# EAGLE design synchronizer v1.1 (EAGLE 6.5.0)

## Sheet 1 of 2: uC
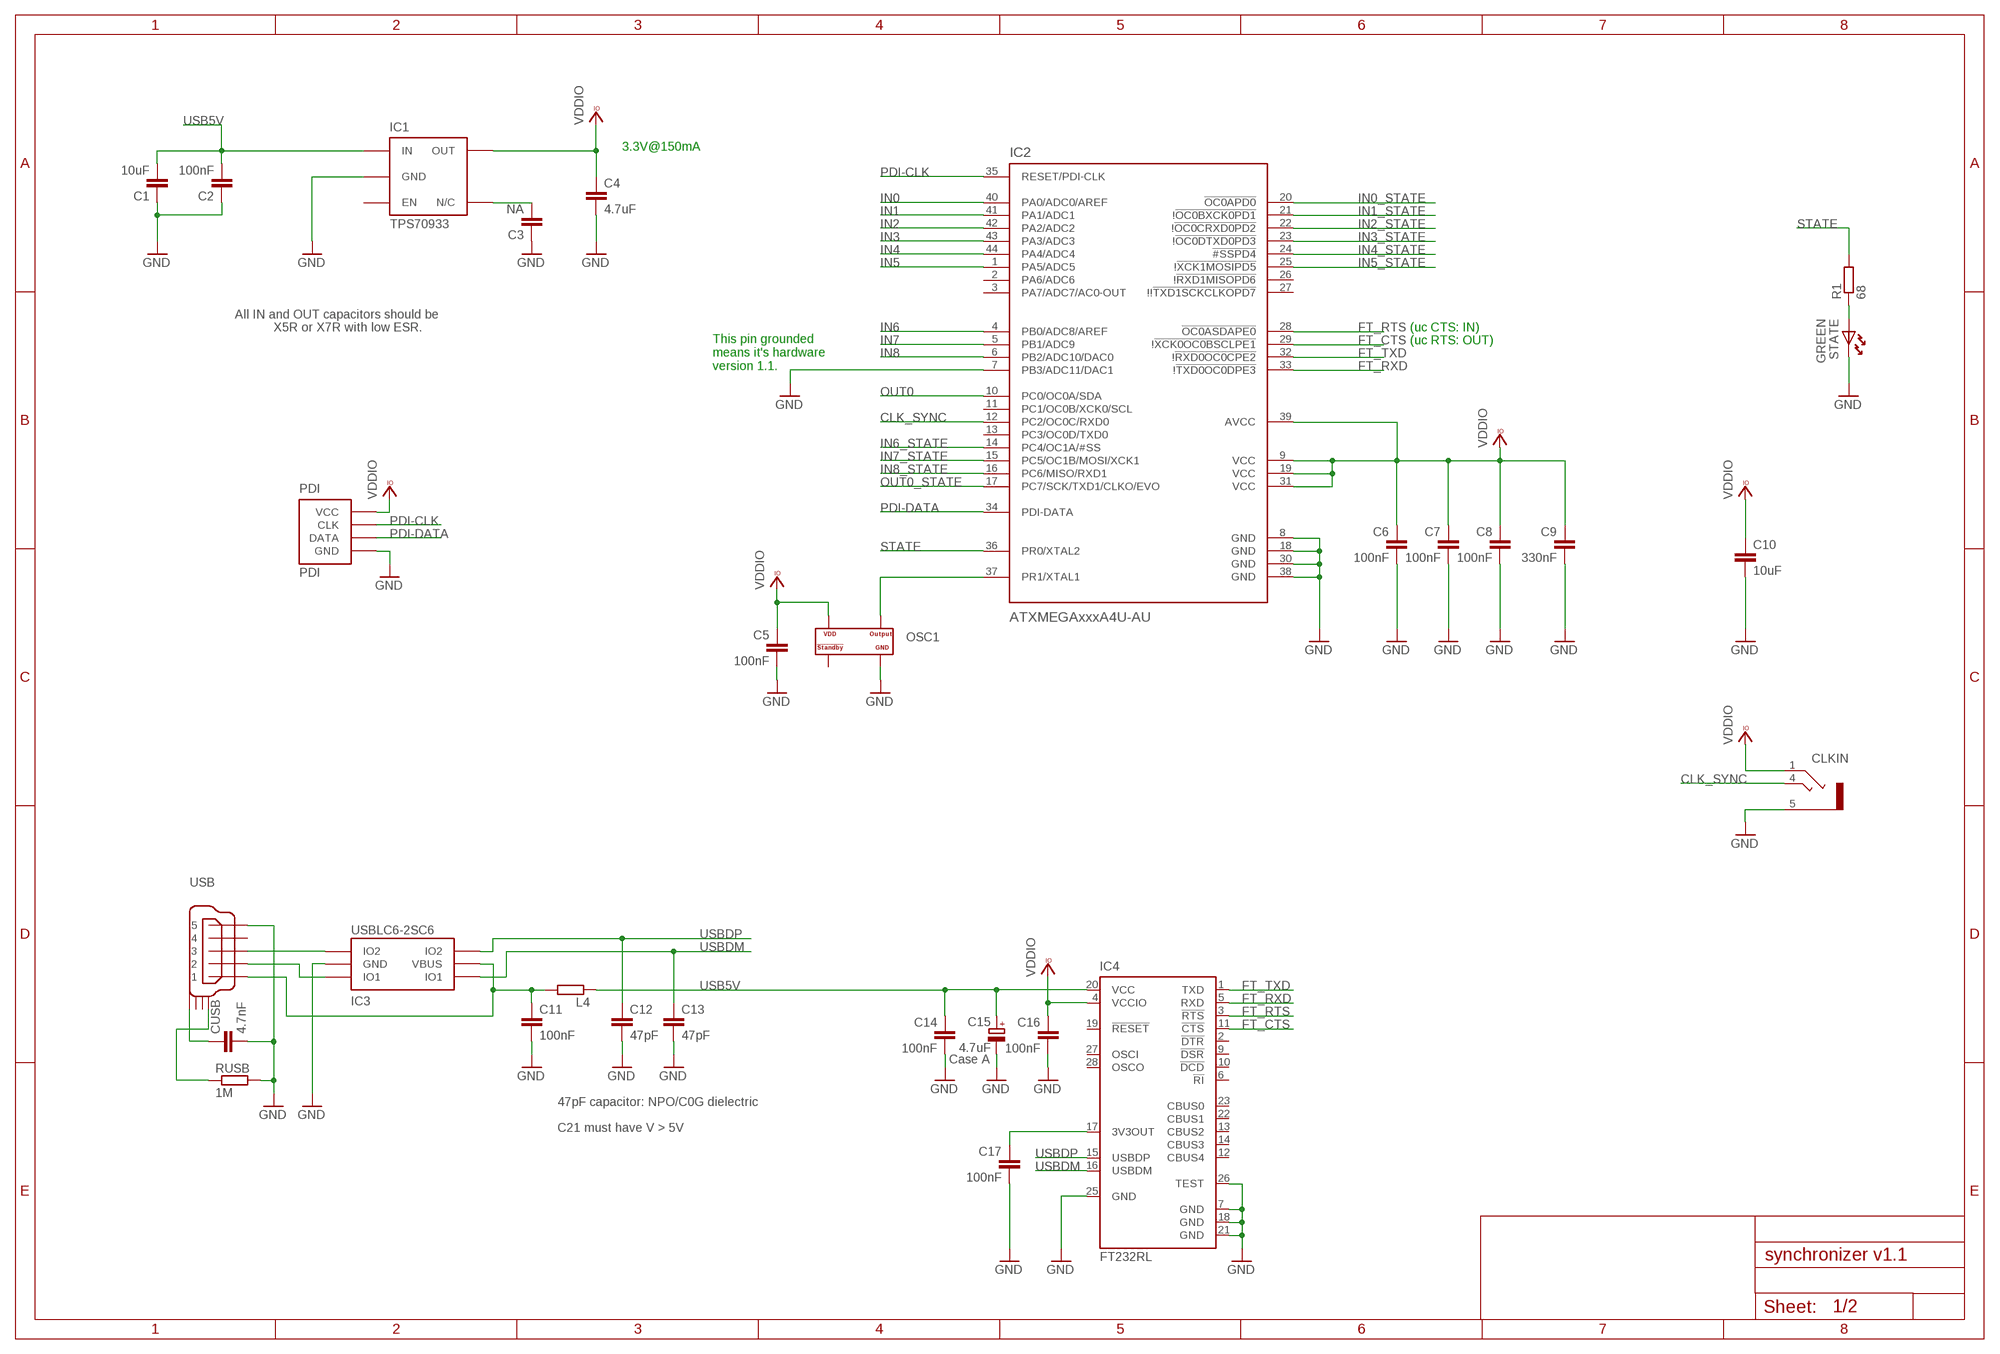
[diagram p0: schematic, sheet 1]

### Parts
C1  10uF  C-EUC0603  [C0603]
C2  100nF  C-EUC0402  [C0402]
C3  NA  C-EUC0402  [C0402]
C4  4.7uF  C-EUC0603  [C0603]
C5  100nF  C-EUC0402  [C0402]
C6  100nF  C-EUC0402  [C0402]
C7  100nF  C-EUC0402  [C0402]
C8  100nF  C-EUC0402  [C0402]
C9  330nF  C-EUC0402  [C0402]
C10  10uF  C-EUC0603  [C0603]
C11  100nF  C-EUC0402  [C0402]
C12  47pF  C-EUC0402  [C0402]
C13  47pF  C-EUC0402  [C0402]
C14  100nF  C-EUC0402  [C0402]
C15  4.7uF  CPOL-EUA/3216-18W  [A/3216-18W]
C16  100nF  C-EUC0402  [C0402]
C17  100nF  C-EUC0402  [C0402]
CLKIN  STEREO_JACK  [35RASMT2BHNTRX]
CUSB  4.7nF  C-EUC0402  [C0402]
IC1  TPS70933  TLV700XX  [TSOT23-5]
IC2  ATXMEGAxxxA4U-AU  AT-XMEGA-XXA4-AU  [QFP80P1200X1200X120-44N]
IC3  USBLC6-2SC6  USBLC6-2  [SOT23-6L]
IC4  FT232RL  [SSOP28]
L4  ???  R-EU_R0805  [R0805]
OSC1  OSCILLATOR  [OSCILLATOR_3.2X2.5]
PDI  PDI  [PDI_2.54_1X4]
R1  68  R-EU_R0402  [R0402]
RUSB  1M  R-EU_R0603  [R0603]
STATE  GREEN  LEDHAND  [LED_HAND]
USB  USB_MINI_B  [240-0002-1]

### Nets
CLK_SYNC: CLKIN.4 IC2.12(PC2/OC0C/RXD0)
FT_CTS: IC2.29(!!XCK0OC0BSCLPE1) IC4.11(!CTS)
FT_RTS: IC2.28(!OC0ASDAPE0) IC4.3(!RTS)
FT_RXD: IC2.33(!!TXD0OC0DPE3) IC4.5(RXD)
FT_TXD: IC2.32(!!RXD0OC0CPE2) IC4.1(TXD)
GND: C1.1 C2.1 C3.1 C4.2 C5.2 C6.2 C7.2 C8.2 C9.2 C10.2 C11.2 C12.2 C13.2 C14.2 C15.- C16.2 C17.2 CLKIN.5 CUSB.2 IC1.2(GND) IC2.7(PB3/ADC11/DAC1) IC2.8(GND) IC2.18(GND) IC2.30(GND) IC2.38(GND) IC3.P$2(GND) IC4.7(GND) IC4.18(GND) IC4.21(GND) IC4.25(GND) IC4.26(TEST) OSC1.P$2(GND) PDI.P$1(GND) RUSB.2 STATE.K USB.P$5 ; also sheet 2
IN0: IC2.40(PA0/ADC0/AREF) ; also sheet 2
IN0_STATE: IC2.20(!OC0APD0) ; also sheet 2
IN1: IC2.41(PA1/ADC1) ; also sheet 2
IN1_STATE: IC2.21(!!OC0BXCK0PD1) ; also sheet 2
IN2: IC2.42(PA2/ADC2) ; also sheet 2
IN2_STATE: IC2.22(!!OC0CRXD0PD2) ; also sheet 2
IN3: IC2.43(PA3/ADC3) ; also sheet 2
IN3_STATE: IC2.23(!!OC0DTXD0PD3) ; also sheet 2
IN4: IC2.44(PA4/ADC4) ; also sheet 2
IN4_STATE: IC2.24(!#SSPD4) ; also sheet 2
IN5: IC2.1(PA5/ADC5) ; also sheet 2
IN5_STATE: IC2.25(!!XCK1MOSIPD5) ; also sheet 2
IN6: IC2.4(PB0/ADC8/AREF) ; also sheet 2
IN6_STATE: IC2.14(PC4/OC1A/#SS) ; also sheet 2
IN7: IC2.5(PB1/ADC9) ; also sheet 2
IN7_STATE: IC2.15(PC5/OC1B/MOSI/XCK1) ; also sheet 2
IN8: IC2.6(PB2/ADC10/DAC0) ; also sheet 2
IN8_STATE: IC2.16(PC6/MISO/RXD1) ; also sheet 2
N$23: R1.1 STATE.A
N$32: C3.2 IC1.4(N/C)
N$38: C17.1 IC4.17(3V3OUT)
N$39: C11.1 IC3.P$5(VBUS) L4.2 USB.P$1
N$40: IC3.P$1(IO1) USB.P$2
N$50: IC3.P$3(IO2) USB.P$3
N$59: CUSB.1 USB.SHIELD_4
N$61: RUSB.1 USB.SHIELD_1
OSC1: IC2.37(PR1/XTAL1) OSC1.P$3(OUTPUT)
OUT0: IC2.10(PC0/OC0A/SDA) ; also sheet 2
OUT0_STATE: IC2.17(PC7/SCK/TXD1/CLKO/EVO) ; also sheet 2
PDI-CLK: IC2.35(RESET/PDI-CLK) PDI.P$3(CLK)
PDI-DATA: IC2.34(PDI-DATA) PDI.P$2(DATA)
STATE: IC2.36(PR0/XTAL2) R1.2
USB5V: C1.2 C2.2 C14.1 C15.+ IC1.1(IN) IC4.20(VCC) L4.1 ; also sheet 2
USBDM: C13.1 IC3.P$6(IO1) IC4.16(USBDM)
USBDP: C12.1 IC3.P$4(IO2) IC4.15(USBDP)
VCCIO: C4.1 C5.1 C6.1 C7.1 C8.1 C9.1 C10.1 C16.1 CLKIN.1 IC1.5(OUT) IC2.9(VCC) IC2.19(VCC) IC2.31(VCC) IC2.39(AVCC) IC4.4(VCCIO) OSC1.P$4(VDD) PDI.P$4(VCC) ; supply symbol labelled VDDIO ; also sheet 2
Unconnected: IC1.3(EN) IC2.2(PA6/ADC6) IC2.3(PA7/ADC7/AC0-OUT) IC2.11(PC1/OC0B/XCK0/SCL) IC2.13(PC3/OC0D/TXD0) IC2.26(!!RXD1MISOPD6) IC2.27(!!!TXD1SCKCLKOPD7) IC4.2(!DTR) IC4.6(!RI) IC4.9(!DSR) IC4.10(!DCD) IC4.12(CBUS4) IC4.13(CBUS2) IC4.14(CBUS3) IC4.19(!RESET) IC4.22(CBUS1) IC4.23(CBUS0) IC4.27(OSCI) IC4.28(OSCO) OSC1.P$1(STANDBY#) USB.P$4 USB.SHIELD_2 USB.SHIELD_3

### Notes on the sheet
- 3.3V@150mA
- All IN and OUT capacitors should be
- X5R or X7R with low ESR. | (uc CTS: IN)
- (uc RTS: OUT)
- This pin grounded
  means it's hardware
  version 1.1.
- Case A
- 47pF capacitor: NPO/C0G dielectric
- C21 must have V > 5V

## Sheet 2 of 2
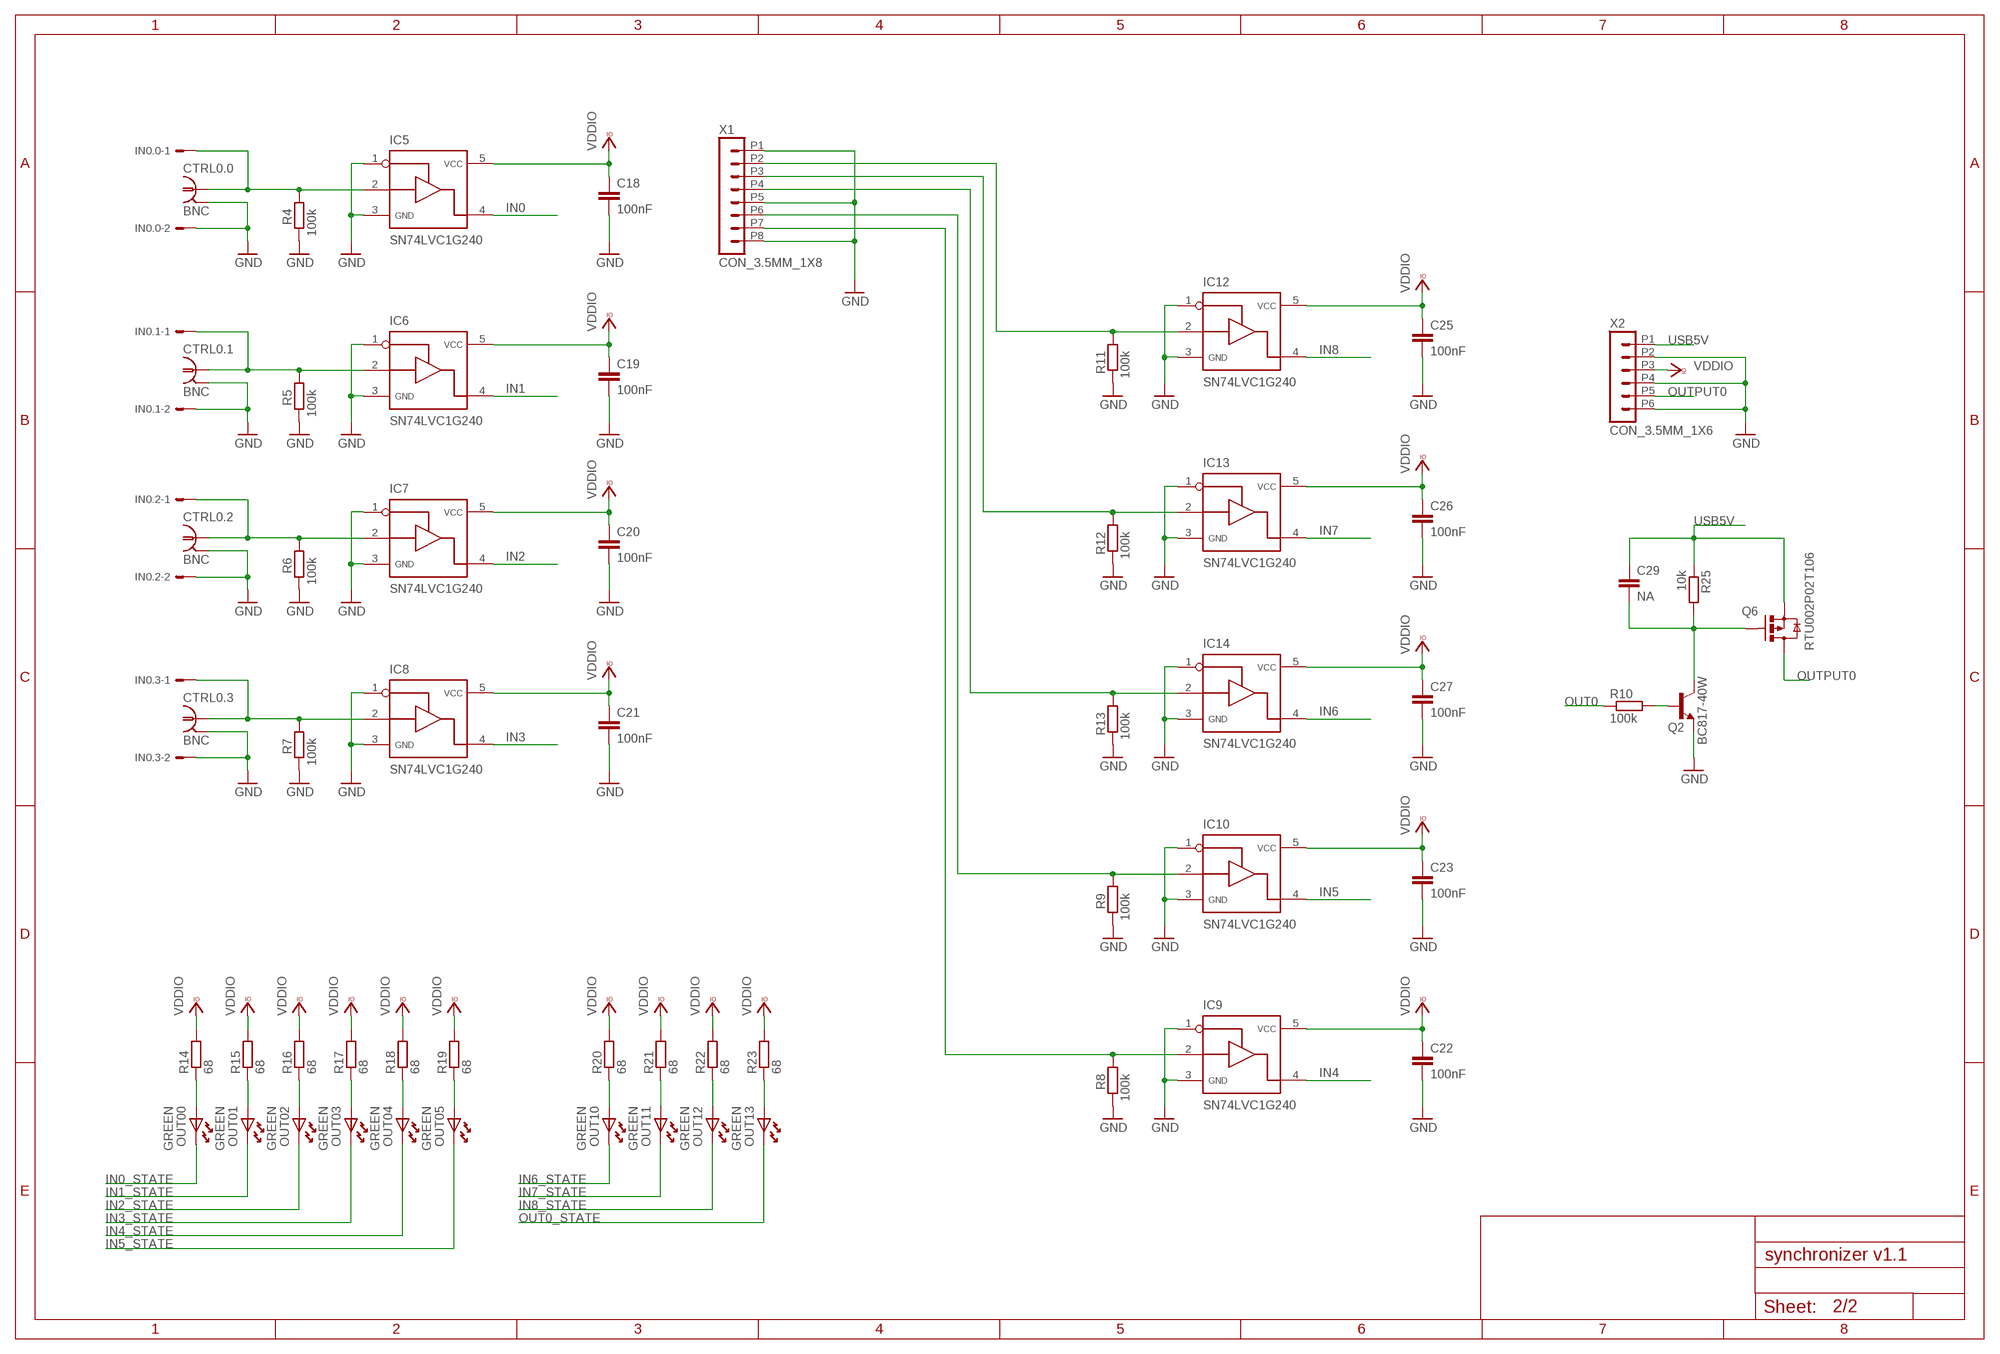
[diagram p1: schematic, sheet 2]

### Parts
C18  100nF  C-EUC0402  [C0402]
C19  100nF  C-EUC0402  [C0402]
C20  100nF  C-EUC0402  [C0402]
C21  100nF  C-EUC0402  [C0402]
C22  100nF  C-EUC0402  [C0402]
C23  100nF  C-EUC0402  [C0402]
C25  100nF  C-EUC0402  [C0402]
C26  100nF  C-EUC0402  [C0402]
C27  100nF  C-EUC0402  [C0402]
C29  NA  C-EUC0402  [C0402]
CTRL0.0  BNC  [BNC_RA]
CTRL0.1  BNC  [BNC_RA]
CTRL0.2  BNC  [BNC_RA]
CTRL0.3  BNC  [BNC_RA]
IC5  SN74LVC1G240  SN74LVC1G125  [SOT23-5]
IC6  SN74LVC1G240  SN74LVC1G125  [SOT23-5]
IC7  SN74LVC1G240  SN74LVC1G125  [SOT23-5]
IC8  SN74LVC1G240  SN74LVC1G125  [SOT23-5]
IC9  SN74LVC1G240  SN74LVC1G125  [SOT23-5]
IC10  SN74LVC1G240  SN74LVC1G125  [SOT23-5]
IC12  SN74LVC1G240  SN74LVC1G125  [SOT23-5]
IC13  SN74LVC1G240  SN74LVC1G125  [SOT23-5]
IC14  SN74LVC1G240  SN74LVC1G125  [SOT23-5]
IN0.0  22-05-7028-02  [7395-02]
IN0.1  22-05-7028-02  [7395-02]
IN0.2  22-05-7028-02  [7395-02]
IN0.3  22-05-7028-02  [7395-02]
OUT00  GREEN  LEDHAND  [LED_HAND]
OUT01  GREEN  LEDHAND  [LED_HAND]
OUT02  GREEN  LEDHAND  [LED_HAND]
OUT03  GREEN  LEDHAND  [LED_HAND]
OUT04  GREEN  LEDHAND  [LED_HAND]
OUT05  GREEN  LEDHAND  [LED_HAND]
OUT10  GREEN  LEDHAND  [LED_HAND]
OUT11  GREEN  LEDHAND  [LED_HAND]
OUT12  GREEN  LEDHAND  [LED_HAND]
OUT13  GREEN  LEDHAND  [LED_HAND]
Q2  BC817-40W  BC817  [SOT323-BEC]
Q6  RTU002P02T106  MOSFET-PCHANNEL-ROHM  [SOT323]
R4  100k  R-EU_R0402  [R0402]
R5  100k  R-EU_R0402  [R0402]
R6  100k  R-EU_R0402  [R0402]
R7  100k  R-EU_R0402  [R0402]
R8  100k  R-EU_R0402  [R0402]
R9  100k  R-EU_R0402  [R0402]
R10  100k  R-EU_R0402  [R0402]
R11  100k  R-EU_R0402  [R0402]
R12  100k  R-EU_R0402  [R0402]
R13  100k  R-EU_R0402  [R0402]
R14  68  R-EU_R0402  [R0402]
R15  68  R-EU_R0402  [R0402]
R16  68  R-EU_R0402  [R0402]
R17  68  R-EU_R0402  [R0402]
R18  68  R-EU_R0402  [R0402]
R19  68  R-EU_R0402  [R0402]
R20  68  R-EU_R0402  [R0402]
R21  68  R-EU_R0402  [R0402]
R22  68  R-EU_R0402  [R0402]
R23  68  R-EU_R0402  [R0402]
R25  10k  R-EU_R0402  [R0402]
X1  CON_3.5MM_1X8  [CON_3.5MM_1X8]
X2  CON_3.5MM_1X6  [CON_3.5MM_1X6]

### Nets
GND: C18.2 C19.2 C20.2 C21.2 C22.2 C23.2 C25.2 C26.2 C27.2 CTRL0.0.2 CTRL0.1.2 CTRL0.2.2 CTRL0.3.2 IC5.1 IC5.3 IC6.1 IC6.3 IC7.1 IC7.3 IC8.1 IC8.3 IC9.1 IC9.3 IC10.1 IC10.3 IC12.1 IC12.3 IC13.1 IC13.3 IC14.1 IC14.3 IN0.0.2 IN0.1.2 IN0.2.2 IN0.3.2 Q2.E R4.2 R5.2 R6.2 R7.2 R8.2 R9.2 R11.2 R12.2 R13.2 X1.P1 X1.P5 X1.P8 X2.P2 X2.P4 X2.P6 ; also sheet 1
IN0: IC5.4 ; also sheet 1
IN0_STATE: OUT00.K ; also sheet 1
IN1: IC6.4 ; also sheet 1
IN1_STATE: OUT01.K ; also sheet 1
IN2: IC7.4 ; also sheet 1
IN2_STATE: OUT02.K ; also sheet 1
IN3: IC8.4 ; also sheet 1
IN3_STATE: OUT03.K ; also sheet 1
IN4: IC9.4 ; also sheet 1
IN4_STATE: OUT04.K ; also sheet 1
IN5: IC10.4 ; also sheet 1
IN5_STATE: OUT05.K ; also sheet 1
IN6: IC14.4 ; also sheet 1
IN6_STATE: OUT10.K ; also sheet 1
IN7: IC13.4 ; also sheet 1
IN7_STATE: OUT11.K ; also sheet 1
IN8: IC12.4 ; also sheet 1
IN8_STATE: OUT12.K ; also sheet 1
N$1: CTRL0.1.1 IC6.2 IN0.1.1 R5.1
N$2: CTRL0.2.1 IC7.2 IN0.2.1 R6.1
N$3: CTRL0.3.1 IC8.2 IN0.3.1 R7.1
N$5: IC12.2 R11.1 X1.P2
N$6: IC13.2 R12.1 X1.P3
N$7: IC14.2 R13.1 X1.P4
N$9: OUT00.A R14.1
N$10: OUT01.A R15.1
N$11: OUT02.A R16.1
N$12: OUT03.A R17.1
N$13: OUT04.A R18.1
N$14: OUT05.A R19.1
N$15: OUT10.A R20.1
N$16: OUT11.A R21.1
N$18: OUT12.A R22.1
N$19: OUT13.A R23.1
N$21: IC9.2 R8.1 X1.P7
N$22: IC10.2 R9.1 X1.P6
N$26: CTRL0.0.1 IC5.2 IN0.0.1 R4.1
N$28: C29.2 Q2.C Q6.2(G) R25.2
N$29: Q2.B R10.2
OUT0: R10.1 ; also sheet 1
OUT0_STATE: OUT13.K ; also sheet 1
OUTPUT0: Q6.3(D) X2.P5
USB5V: C29.1 Q6.1(S) R25.1 X2.P1 ; also sheet 1
VCCIO: C18.1 C19.1 C20.1 C21.1 C22.1 C23.1 C25.1 C26.1 C27.1 IC5.5 IC6.5 IC7.5 IC8.5 IC9.5 IC10.5 IC12.5 IC13.5 IC14.5 R14.2 R15.2 R16.2 R17.2 R18.2 R19.2 R20.2 R21.2 R22.2 R23.2 X2.P3 ; supply symbol labelled VDDIO ; also sheet 1

## Library data of the parts
C1-C14 C16-C23 C25-C27 C29 CUSB = rcl:C-EU: CAPACITOR, European symbol
C15 = rcl:CPOL-EU: POLARIZED CAPACITOR, European symbol
CLKIN = CNP-connectors:STEREO_JACK
CTRL0.0 CTRL0.1-CTRL0.3 = CNP-connectors:BNC
IC1 = CNP-ics 2:TLV700XX
IC2 = xmega-a4:AT-XMEGA-XXA4-AU: ATxMega a4 Serie
IC3 = CNP 2:USBLC6-2
IC4 = ftdichip:FT232R: Source: http://www.ftdichip.com/Documents/DataSheets/DS_FT232R_v104.pdf; MPN: FT232RL; OC_FARNELL: 1146032; OC_NEWARK: 91K9918
IC5-IC10 IC12-IC14 = My_library 0v2:SN74LVC1G125
IN0.0 IN0.1-IN0.3 = con-molex:22-?-02: CONNECTOR wire to board 2.54 mm (.1 inch) pitch header; OC_FARNELL: 9731601; OC_NEWARK: unknown
L4 R1 R4-R23 R25 RUSB = rcl:R-EU_: RESISTOR, European symbol
OSC1 = CNP-miscellaneous:OSCILLATOR
OUT00 OUT01-OUT05 OUT10-OUT13 STATE = CNP-miscellaneous:LED
PDI = CNP-connectors:PDI
Q2 = transistor-npn:BC817*: NPN Transistor
Q6 = MOSFET:MOSFET-PCHANNEL-ROHM: PMOS (RTU002P02) Low On-Resistance. Low Gate Threshold Voltage. Low Input Capacitance. Fast Switching Speed. Manufacturer: ROHM
USB = CNP-connectors:USB_MINI_B
X1 = CNP-connectors:CON_3.5MM_1X8
X2 = CNP-connectors:CON_3.5MM_1X6

## Board
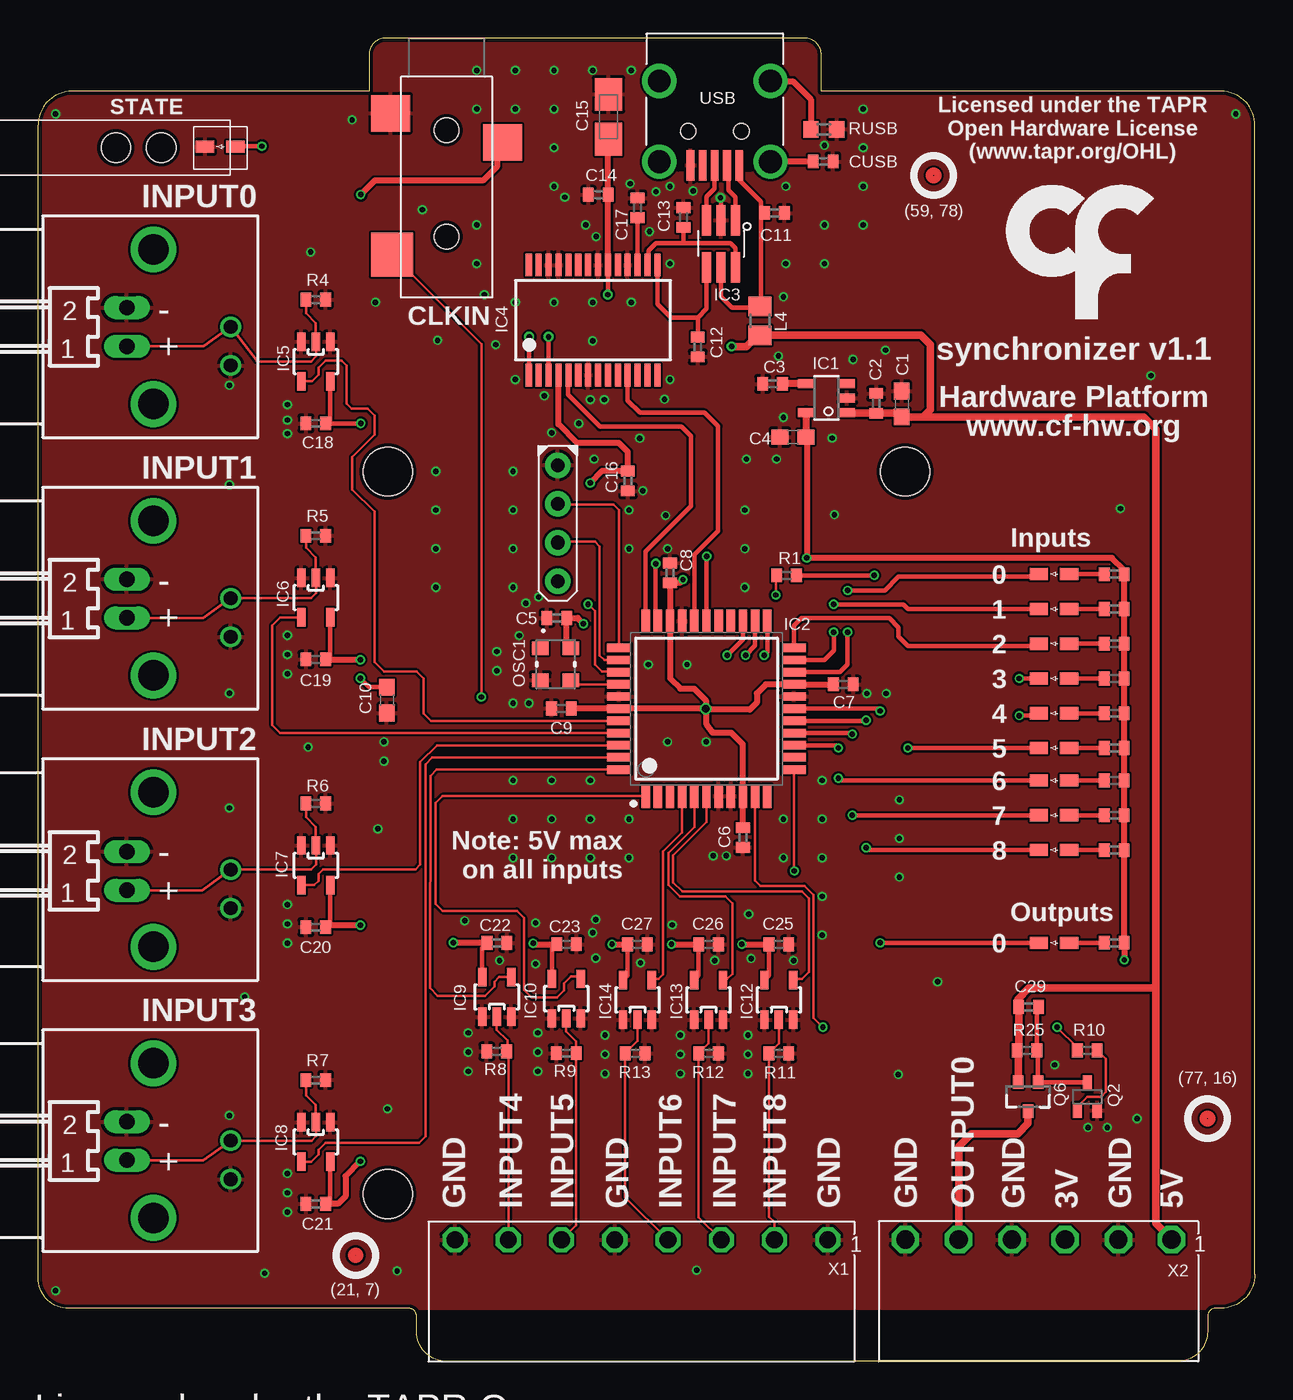
[diagram p2: board, top side]
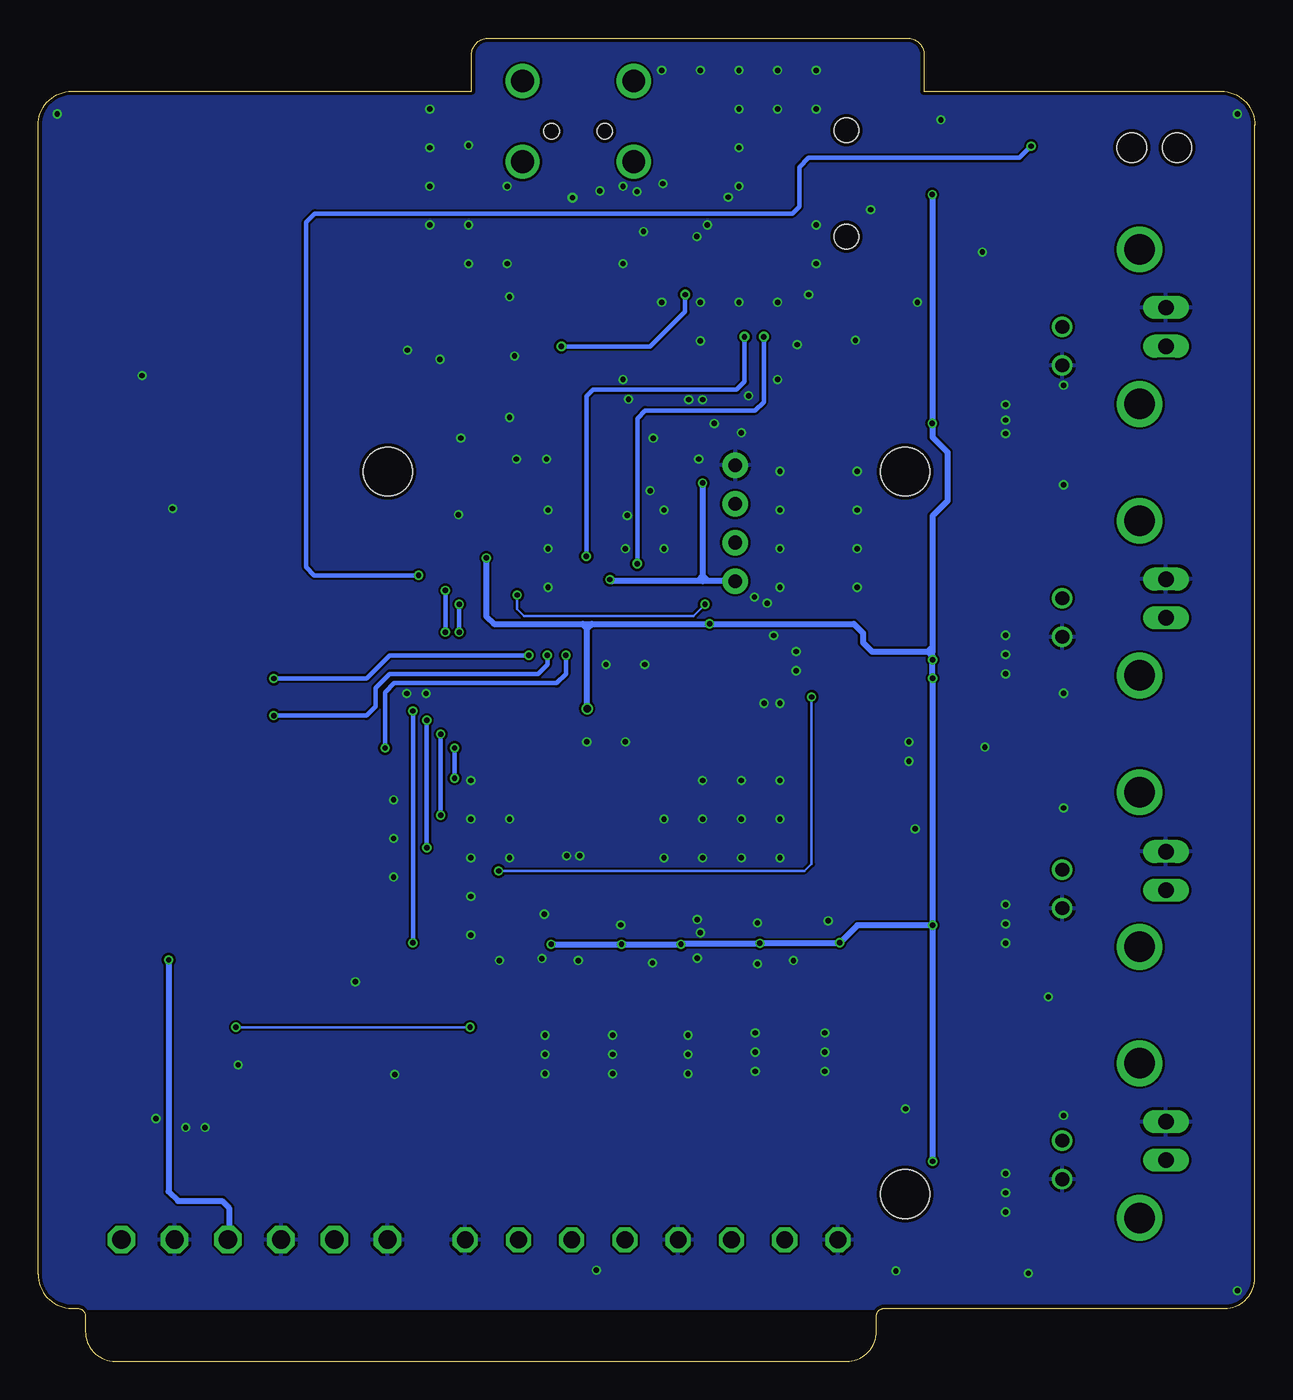
[diagram p3: board, bottom side, seen from below]

Size 80 x 87 mm. Coordinates in mm from the lower left corner, seen from the top.
Outline: 77.76,83.5 51.5,83.5 51.5,85.88 arc90 50.38,87 22.87,87 arc90 21.75,85.88 21.75,83.5 2.24,83.5 arc90 0,81.26 0,5.5 arc90 2,3.5 24.36,3.5 arc-90 24.88,2.97 24.88,1.97 arc90 26.86,0 74.91,0 arc90 76.88,1.97 76.88,2.97 arc-90 77.41,3.5 77.76,3.5 arc90 80,5.74 80,81.26 arc90 77.76,83.5
Copper layers (1*16): Top 0.018mm / dielectric 1.55mm / Bottom 0.018mm
Design rules "eC_2Layer_PClass6_BaseCopperO18_eCDefault *": minimum track width 0.15mm, minimum drill 0.35mm, track to track 0.15mm, track to pad 0.15mm, pad to pad 0.15mm, via to via 0.15mm, smd to smd 0mil, copper to edge 0.25mm, drill to drill 0.35mm, minimum pad ring 0.175mm, minimum via ring 0.125mm, stop-mask expansion 0mil, vias tented up to drill 0.45mm, thermal gap 0.2mm
Holes 3.2 mm at 57,58.5 23,58.5 23,11

### Footprints (pad centres in the part's own frame; a part is rotated, then mirrored left to right if it is on the bottom)
C0603 = smd 1.1 x 1: 1 -0.85,0; 2 0.85,0
C0402 = smd 0.7 x 0.9: 1 -0.65,0; 2 0.65,0
A/3216-18W = smd 2.15 x 1.8: + 1.475,0; - -1.475,0
35RASMT2BHNTRX = smd 2.4 x 2.55: 1 0.8,3.675; 5 -1.1,-3.675 | smd 2.9 x 2.75: 4 8.2,-3.575 | hole 1.6: 0,0; 7,0
BNC_RA = drill 0.9 pad 1.27: 1 0,-5.08; 2 -2.54,-5.08 | drill 2: P$1 -5.08,0; P$2 5.08,0
TSOT23-5 = smd 0.6 x 1.05: 1 -0.95,-1.354; 2 0,-1.354; 3 0.95,-1.354; 4 0.95,1.354; 5 -0.95,1.354
QFP80P1200X1200X120-44N = smd 1.55 x 0.55: 1 -5.75,4; 2 -5.75,3.2; 3 -5.75,2.4; 4 -5.75,1.6; 5 -5.75,0.8; 6 -5.75,0; 7 -5.75,-0.8; 8 -5.75,-1.6; 9 -5.75,-2.4; 10 -5.75,-3.2; 11 -5.75,-4; 23 5.75,-4; 24 5.75,-3.2; 25 5.75,-2.4; 26 5.75,-1.6; 27 5.75,-0.8; 28 5.75,0; 29 5.75,0.8; 30 5.75,1.6; 31 5.75,2.4; 32 5.75,3.2; 33 5.75,4 | smd 0.55 x 1.55: 12 -4,-5.75; 13 -3.2,-5.75; 14 -2.4,-5.75; 15 -1.6,-5.75; 16 -0.8,-5.75; 17 0,-5.75; 18 0.8,-5.75; 19 1.6,-5.75; 20 2.4,-5.75; 21 3.2,-5.75; 22 4,-5.75; 34 4,5.75; 35 3.2,5.75; 36 2.4,5.75; 37 1.6,5.75; 38 0.8,5.75; 39 0,5.75; 40 -0.8,5.75; 41 -1.6,5.75; 42 -2.4,5.75; 43 -3.2,5.75; 44 -4,5.75
SOT23-6L = smd 0.6 x 2: P$1 -0.95,-1.55; P$2 0,-1.55; P$3 0.95,-1.55; P$4 0.95,1.55; P$5 0,1.55; P$6 -0.95,1.55
SSOP28 = smd 0.4 x 1.5: 1 -4.225,-3.625; 2 -3.575,-3.625; 3 -2.925,-3.625; 4 -2.275,-3.625; 5 -1.625,-3.625; 6 -0.975,-3.625; 7 -0.325,-3.625; 8 0.325,-3.625; 9 0.975,-3.625; 10 1.625,-3.625; 11 2.275,-3.625; 12 2.925,-3.625; 13 3.575,-3.625; 14 4.225,-3.625; 15 4.225,3.625; 16 3.575,3.625; 17 2.925,3.625; 18 2.275,3.625; 19 1.625,3.625; 20 0.975,3.625; 21 0.325,3.625; 22 -0.325,3.625; 23 -0.975,3.625; 24 -1.625,3.625; 25 -2.275,3.625; 26 -2.925,3.625; 27 -3.575,3.625; 28 -4.225,3.625
SOT23-5 = smd 0.55 x 1.2: 1 -0.95,-1.3; 2 0,-1.3; 3 0.95,-1.3; 4 0.95,1.3; 5 -0.95,1.3
7395-02 = drill 1.016 long: 1 1.27,0; 2 -1.27,0
R0805 = smd 1.3 x 1.5: 1 -0.95,0; 2 0.95,0
OSCILLATOR_3.2X2.5 = smd 0.9 x 1.1: P$1 -1.05,-1; P$2 1.05,-1; P$3 1.05,1; P$4 -1.05,1
LED_HAND = smd 1.2 x 0.8: A -1,0; K 1,0
PDI_2.54_1X4 = drill 0.9 pad 1.676: P$1 -3.81,0; P$2 -1.27,0; P$3 1.27,0; P$4 3.81,0
SOT323-BEC = smd 0.6 x 1: B -0.65,-0.9; C 0,0.9; E 0.65,-0.9
SOT323 = smd 0.7 x 0.9: 1 0.65,-0.95; 2 -0.65,-0.95; 3 0,0.95
R0402 = smd 0.7 x 0.9: 1 -0.65,0; 2 0.65,0
R0603 = smd 1 x 1.1: 1 -0.85,0; 2 0.85,0
LED_PIPE_7513D2-L = hole 1.93: -1.486,0; 1.486,0
240-0002-1 = smd 0.5 x 2: P$1 -1.6,8.65; P$2 -0.8,8.65; P$3 0,8.65; P$4 0.8,8.65; P$5 1.6,8.65 | drill 1.5: SHIELD_1 -3.65,3.1; SHIELD_2 3.65,3.1; SHIELD_3 3.65,8.4; SHIELD_4 -3.65,8.4 | hole 1: -1.75,6.4; 1.75,6.4
CON_3.5MM_1X8 = drill 1.1 octagon: P1 -12.25,0; P2 -8.75,0; P3 -5.25,0; P4 -1.75,0; P5 1.75,0; P6 5.25,0; P7 8.75,0; P8 12.25,0
CON_3.5MM_1X6 = drill 1.2 octagon: P1 -8.44,-2.54; P2 -4.94,-2.54; P3 -1.44,-2.54; P4 2.06,-2.54; P5 5.56,-2.54; P6 9.06,-2.54

### Placement (x,y rotation side)
C1  56.77,62.94 270 top
C2  55.1,62.98 270 top
C3  48.29,64.26 0 top
C4  49.62,60.76 180 top
C5  34.1,48.87 180 top
C6  46.35,34.44 270 top
C7  52.94,44.51 0 top
C8  41.55,51.84 90 top
C9  34.4,42.93 180 top
C10  22.93,43.48 270 top
C11  48.42,75.49 0 top
C12  43.37,66.69 270 top
C13  42.43,75.2 90 top
C14  36.83,76.7 180 top
C15  37.51,81.82 270 top
C16  38.78,57.88 270 top
C17  39.41,75.84 90 top
C18  18.26,61.67 180 top
C19  18.26,46.15 180 top
C20  18.26,28.55 180 top
C21  18.26,10.37 180 top
C22  30.17,27.51 0 top
C23  34.74,27.43 0 top
C25  48.7,27.42 0 top
C26  44.08,27.42 0 top
C27  39.41,27.42 0 top
C29  65.12,23.31 0 top
CLKIN  26.86,80.95 270 top
CTRL0.0  7.58,68.02 90 top
CTRL0.1  7.58,50.18 90 top
CTRL0.2  7.58,32.34 90 top
CTRL0.3  7.58,14.52 90 top
CUSB  51.62,78.88 0 top
IC1  51.83,63.34 90 top
IC2  43.95,42.91 90 top
IC3  44.9,73.47 180 top
IC4  36.49,68.46 0 top
IC5  18.26,65.73 180 top
IC6  18.26,50.22 180 top
IC7  18.26,32.62 180 top
IC8  18.26,14.43 180 top
IC9  30.15,23.96 0 top
IC10  34.72,23.85 0 top
IC12  48.7,23.77 0 top
IC13  44.08,23.77 0 top
IC14  39.41,23.77 0 top
IN0.0  5.85,68.01 270 top
IN0.1  5.85,50.15 270 top
IN0.2  5.85,32.25 270 top
IN0.3  5.85,14.5 270 top
L4  47.46,68.41 90 top
OSC1  34.02,45.84 270 top
OUT00  66.79,51.76 180 top
OUT01  66.79,49.47 180 top
OUT02  66.79,47.18 180 top
OUT03  66.79,44.9 180 top
OUT04  66.79,42.61 180 top
OUT05  66.79,40.33 180 top
OUT10  66.79,38.19 180 top
OUT11  66.79,35.91 180 top
OUT12  66.79,33.62 180 top
OUT13  66.79,27.52 180 top
PDI  34.17,55.1 270 top
Q2  68.97,17.4 0 top
Q6  65.08,17.41 180 top
R1  49.2,51.67 180 top
R4  18.26,69.8 0 top
R5  18.26,54.28 0 top
R6  18.26,36.68 0 top
R7  18.26,18.5 0 top
R8  30.15,20.38 180 top
R9  34.72,20.27 180 top
R10  68.97,20.45 0 top
R11  48.7,20.26 0 top
R12  44.08,20.26 0 top
R13  39.25,20.26 0 top
R14  70.75,51.76 0 top
R15  70.75,49.47 0 top
R16  70.75,47.18 0 top
R17  70.75,44.9 0 top
R18  70.75,42.61 0 top
R19  70.75,40.33 0 top
R20  70.75,38.19 0 top
R21  70.75,35.91 0 top
R22  70.75,33.62 0 top
R23  70.75,27.52 0 top
R25  65.01,20.45 0 top
RUSB  51.65,80.99 0 top
STATE  11.98,79.85 180 top
U$1  [LED_PIPE_7513D2-L]  6.61,79.79 0 top
U$2  [FIDUCIAL]  76.88,15.97 0 top
U$3  [FIDUCIAL]  58.88,77.97 0 top
U$7  [FIDUCIAL]  20.88,6.97 0 top
U$9  [LOGO_6]  66.81,74.26 0 top
USB  44.49,87.28 180 top
X1  39.67,7.99 180 top
X2  66.08,5.47 180 top

### Tracks (layer width: path | path; a pad name or v marks a point on that pad's centre or on a via)
CLK_SYNC  (via drill 0.35)
  Top 0.152: IC2.12 49.7,32.27 v49.72,32.25 | v29.14,43.68 29.14,66.89 CLKIN.4
  Bottom 0.152: v49.72,32.25 29.6,32.25 29.14,32.71 v29.14,43.68
FT_CTS
  Top 0.305: 38.78,64.82 IC4.11 | IC4.11 | IC2.29 43.15,53.03 44.71,54.59 44.71,61.48 43.83,62.36 39.56,62.36 38.77,63.16 IC4.11
FT_RTS  (via drill 0.35 pad 0.65)
  Top 0.305: v33.56,67.36 IC4.3 | v43.96,52.93 43.96,48.67 IC2.28
  Bottom 0.305: v43.96,52.93 43.96,63.45 43.52,63.89 34.07,63.89 33.56,64.4 v33.56,67.36
FT_RXD
  Top 0.305: IC4.5 34.83,64.79 34.83,63.55 36.93,61.45 42.3,61.45 42.93,60.82 42.93,56.25 42.33,55.65 42.33,55.63 39.95,53.25 IC2.33
  Top 0.406: 34.87,64.82 IC4.5
FT_TXD  (via drill 0.35 pad 0.65)
  Top 0.305: v32.29,67.36 32.29,64.85 | v40.6,52.45 40.6,48.8 IC2.32
  Top 0.406: 32.29,64.85 IC4.1
  Bottom 0.305: v40.6,52.45 40.6,62 40.09,62.51 32.85,62.51 32.29,63.08 v32.29,67.36
GND  (via drill 0.35, 0.35 pad 0.65)
  Top 0.305: 53.15,63.3 IC1.2 | IC3.P$2 44.9,76.47 v44.86,76.51
  Top 0.406: IC2.8
  other vias: 20.65,81.62 28.84,84.87 28.84,72.17 12.58,64.17 12.58,57.63 49.01,62.07 71.16,56.07 12.58,36.39 12.58,43.93 13.58,23.97 12.58,16.17 31.23,43.27 41.39,40.73 43.93,40.73 51.55,38.19 51.55,35.65 51.55,33.11 36.31,38.19 33.77,38.19 31.23,38.19 31.23,35.65 33.77,35.65 36.31,35.65 38.85,35.65 49.01,35.65 49.01,33.11 38.85,33.11 36.31,33.11 33.77,33.11 31.23,33.11 51.55,28.03 51.55,30.57 46.72,29.4 46.47,50.89 31.23,50.89 31.23,55.97 38.85,55.97 38.85,53.43 41.39,53.43 36.31,63.24 46.47,55.97 46.47,53.43 33.92,69.63 36.46,67.09 31.38,69.63 29.34,70.13 30.09,66.84 35.55,61.66 31.38,64.55 41.54,64.55 48.68,66.1 49.01,69.99 49.16,72.17 41.54,72.17 39,69.63 36.46,69.63 28.84,74.71 36,74.71 33.92,77.25 33.92,79.79 38.92,77.43 41.54,77.25 33.92,82.33 31.38,82.33 28.84,82.33 31.38,84.87 33.92,84.87 39,84.87 36.46,84.87 54.24,82.33 51.7,79.94 54.24,79.79 54.24,77.25 51.7,74.71 49.16,77.25 54.24,74.71 51.7,72.17 45.25,33.24 22.74,40.73 22.74,39.46 16.39,46.47 16.39,61.89 16.39,28.77 16.39,11.09 42.66,45.81 40.12,45.81 69.02,15.38 70.29,15.38 56.63,36.92 56.63,34.38 31.23,53.43 31.23,58.51 33.77,61.05 26.15,50.89 26.15,53.43 26.15,55.97 26.15,58.51 22.19,69.63 17.92,72.93 26.27,67.13 25.27,75.71 16.39,27.5 16.39,30.04 16.39,45.2 16.39,47.74 16.39,62.9 16.39,61 16.39,12.36 16.39,9.82 32.7,26.13 46.88,26.49 32.7,28.82 36.66,26.51 41.69,28.7 36.66,29.05 37.27,21.45 37.27,20.18 37.27,18.91 42.23,18.91 42.23,20.18 42.23,21.45 46.67,18.91 46.67,20.18 46.67,21.45 44.38,33.24 32.27,43.27 54.49,43.91 55.76,43.91 32.9,50.26 31.63,47.72 32.07,49.85 30.16,45.41 30.16,46.68 41.26,55.62 39.76,57.24 36.56,59.32 33.29,63.49 41.18,63.26 39.56,60.69 36.69,73.95 43.06,76.95 40.19,74.28 40.63,76.9 34.63,76.54 1.15,4.66 78.73,82.01 1.15,82.01 30.34,26.36 28.05,28.97 43.29,6 23.61,5.95 14.89,5.8 17.76,40.38 22.34,35.02 22.97,16.6 36.46,28.18 73.16,64.81 39.61,26.2 66.84,19.5 56.63,31.84 72.25,15.97 56.55,18.86 59.14,24.96 28.28,21.61 28.28,20.34 28.28,19.07 32.85,21.61 32.85,20.34 32.85,19.07 53.58,65.88 55.71,66.49 52.21,60.7 52.36,55.67 48.55,59.32 46.57,59.32 44.49,26.36 49.67,26.36 37.22,63.24
  pour Bottom: -0.12,3.47 80.88,3.47 80.88,83.47 51.38,83.47 51.38,86.97 21.63,86.97 21.63,83.47 -0.12,83.47
  pour Top: -0.12,3.47 80.88,3.47 80.88,83.47 51.38,83.47 51.38,86.97 21.63,86.97 21.63,83.47 -0.12,83.47
IN0
  Top 0.152: IC5.4 18.01,64.43 18.45,64.87 18.45,65.33 18.9,65.78 19.97,65.78 20.27,65.48 20.27,62.98 20.61,62.65 21.68,62.65 22.13,62.19 22.13,60.94 20.66,59.47 20.66,57.33 22.13,55.86 22.13,45.96 22.74,45.36 24.88,45.36 25.34,44.9 25.34,42.61 25.84,42.11 IC2.40
IN0_STATE  (via drill 0.35)
  Top 0.305: IC2.20 52.72,45.31 53.22,45.81 v53.22,47.95 | v53.22,50.69 55.66,50.69 56.58,51.6 65.64,51.6 OUT00.K
  Bottom 0.305: v53.22,47.95 v53.22,50.69
IN1
  Top 0.152: IC2.41 38.21,41.33 15.92,41.33 15.4,41.85 15.4,48.39 15.93,48.92 IC6.4
IN1_STATE  (via drill 0.35)
  Top 0.305: IC2.21 51.69,46.11 52.31,46.73 v52.31,47.95 | v52.31,49.77 56.88,49.77 57.19,49.47 OUT01.K
  Bottom 0.305: v52.31,47.95 v52.31,49.77
IN2
  Top 0.152: IC2.42 26.23,40.51 25.13,39.41 25.13,32.67 24.83,32.36 18.75,32.36 18.45,32.06 18.45,31.6 18.16,31.32 IC7.4
IN2_STATE
  Top 0.305: IC2.22 49.7,48.38 50.18,48.86 55.97,48.86 56.58,48.25 56.58,47.64 57.19,47.03 65.64,47.03 OUT02.K
IN3
  Top 0.152: IC2.43 25.91,39.71 25.46,39.26 25.46,14.79 25.05,14.38 18.9,14.38 18.45,13.92 18.45,13.62 17.96,13.13 IC8.4
IN3_STATE  (via drill 0.35)
  Top 0.305: IC2.23 47.95,46.63 v47.74,46.42 | v64.5,44.9 OUT03.K
  Bottom 0.305: v47.74,46.42 56.88,46.42 58.41,44.9 v64.5,44.9
IN4
  Top 0.152: IC2.44 26.21,38.91 25.79,38.5 25.78,24.54 26.28,24.05 29.4,24.05 30.01,24.66 30.01,24.96 30.32,25.27 IC9.4
IN4_STATE  (via drill 0.35)
  Top 0.305: IC2.24 47.15,47.05 v46.52,46.42 | v64.5,42.46 65.64,42.46 OUT04.K
  Bottom 0.305: v46.52,46.42 46.52,45.81 47.13,45.2 56.88,45.2 57.8,44.29 57.8,43.07 58.41,42.46 v64.5,42.46
IN5
  Top 0.152: IC2.1 26.59,37.16 26.15,36.72 26.15,30.08 26.61,29.62 31.48,29.62 31.94,29.17 31.94,24.44 32.43,23.95 34.12,23.95 34.58,24.4 34.58,24.86 35.04,25.32 35.5,25.32 IC10.4
IN5_STATE  (via drill 0.35)
  Top 0.305: IC2.25 46.35,47.47 v45.3,46.42 | v57.19,40.33 OUT05.K
  Bottom 0.305: v45.3,46.42 45.3,45.2 45.91,44.59 56.58,44.59 57.19,43.98 v57.19,40.33
IN6
  Top 0.152: IC2.4 42.35,34.78 41.08,33.52 41.08,25.44 40.78,25.14 40.43,25.14 IC14.4
IN6_STATE  (via drill 0.35)
  Top 0.305: IC2.14 52.43,40.51 arc-90 v52.61,40.33 | v52.61,38.34 52.77,38.19 OUT10.K
  Bottom 0.305: v52.61,40.33 v52.61,38.34
IN7
  Top 0.152: IC2.5 43.15,35.12 41.44,33.42 41.44,31.34 42.2,30.58 45.2,30.58 45.66,30.12 45.66,25.49 45.3,25.14 45.1,25.14 IC13.4
IN7_STATE  (via drill 0.35)
  Top 0.305: IC2.15 53.46,41.31 arc-90 v53.53,41.24 | v53.53,35.91 OUT11.K
  Bottom 0.305: v53.53,41.24 v53.53,35.91
IN8
  Top 0.152: IC2.6 43.95,35.47 41.74,33.26 41.74,31.5 42.35,30.89 50.23,30.89 50.68,30.43 50.68,25.59 50.23,25.14 49.72,25.14 IC12.4
IN8_STATE  (via drill 0.35)
  Top 0.305: IC2.16 54.4,42.11 v54.44,42.15 | v54.44,33.77 54.6,33.62 OUT12.K
  Bottom 0.305: v54.44,42.15 v54.44,33.77
N$1
  Top 0.152: R5.1 17.61,53.49 18.26,52.84 IC6.2 18.29,51.48 18.29,50.52 17.95,50.18 CTRL0.1.1 10.87,48.88 IN0.1.1
N$2
  Top 0.152: R6.1 17.61,35.79 18.26,35.14 IC7.2 18.29,33.88 18.29,32.67 17.96,32.34 CTRL0.2.1 10.81,30.98 IN0.2.1
N$3
  Top 0.152: R7.1 17.61,17.5 18.26,16.85 IC8.2 18.29,15.7 18.29,14.84 17.98,14.52 CTRL0.3.1 10.87,13.23 IN0.3.1
N$5
  Top 0.152: IC12.2 48.7,20.91 R11.1 48.05,9.52 48.4,9.17 48.4,8.01 X1.P2
N$6
  Top 0.152: IC13.2 44.08,20.91 R12.1 43.43,9.48 X1.P3
N$7
  Top 0.152: IC14.2 39.41,21.06 R13.1 38.6,10.81 X1.P4
N$9
  Top 0.305: OUT00.A R14.1
N$10
  Top 0.305: R15.1 OUT01.A
N$11
  Top 0.305: OUT02.A R16.1
N$12
  Top 0.305: OUT03.A R17.1
N$13
  Top 0.305: OUT04.A R18.1
N$14
  Top 0.305: OUT05.A R19.1
N$15
  Top 0.305: OUT10.A R20.1
N$16
  Top 0.305: R21.1 OUT11.A
N$18
  Top 0.305: OUT12.A R22.1
N$19
  Top 0.305: R23.1 OUT13.A
N$21
  Top 0.152: IC9.2 30.15,21.81 30.86,21.1 30.86,20.44 R8.1 30.92,20.27 X1.P7
N$22
  Top 0.152: IC10.2 34.73,21.71 35.38,21.06 R9.1 35.38,8.95 X1.P6
N$23  (via drill 0.35)
  Top 0.305: R1.1 v54.97,51.67 v54.98,51.68 | v14.72,79.89 13.01,79.89 STATE.A
  Bottom 0.305: v54.98,51.68 61.84,51.68 62.37,52.21 62.37,74.91 61.81,75.47 30.42,75.47 29.96,75.93 29.96,78.52 29.35,79.13 15.48,79.13 v14.72,79.89
N$26
  Top 0.152: R4.1 17.61,68.91 18.26,68.26 IC5.2 18.29,67 18.29,66.09 17.94,65.73 14.45,65.73 CTRL0.0.1 10.88,66.74 IN0.0.1
N$28
  Top 0.305: C29.2 65.66,23.2 R25.2 65.73,20.38 Q6.2 68.91,18.36 Q2.C
N$29
  Top 0.152: Q2.B 68.32,16.75 68.97,17.4 69.89,17.4 70.19,17.71 70.19,19.88 R10.2
N$32
  Top 0.152: 48.87,64.29 C3.2
  Top 0.457: IC1.4 48.96,64.29 C3.2
N$38
  Top 0.305: IC4.17 39.42,74.88 C17.1
N$39
  Top 0.305: IC3.P$5 44.9,69.99 45.62,69.27 46.89,69.27 47.53,69.91 | 47.53,69.91 47.53,75.62 | 47.53,75.62 47.53,76.25 46.03,77.75 46.04,78.58 USB.P$1 | C11.1 47.65,75.49 47.53,75.62 | 47.53,69.91 47.53,69.42 L4.2
N$40
  Top 0.305: 45.32,78.6 USB.P$2 45.38,78.54 45.38,76.99 45.85,76.52 IC3.P$1
N$50
  Top 0.305: 44.47,78.6 USB.P$3 44.48,78.62 44.48,77.09 43.95,76.56 IC3.P$3
N$59
  Top 0.406: CUSB.1 USB.SHIELD_4
N$61
  Top 0.406: USB.SHIELD_1 48.16,84.16 49.62,84.16 50.8,82.97 RUSB.1
OSC1
  Top 0.152: IC2.37 35.3,44.51 OSC1.P$3
OUT0  (via drill 0.35)
  Top 0.152: IC2.10 47.15,31.61 47.48,31.27 50.38,31.27 50.99,30.66 50.99,22.59 v51.6,21.98 | v66.99,21.98 68.32,20.64 R10.1
  Bottom 0.152: v51.6,21.98 v66.99,21.98
OUT0_STATE  (via drill 0.35)
  Top 0.305: v55.36,27.52 OUT13.K | IC2.17 55.36,42.91 v55.36,42.76
  Bottom 0.305: v55.36,42.76 v55.36,27.52
OUTPUT0
  Top 0.508: Q6.3 65.08,15.65 64.4,14.97 61.35,14.97 60.52,14.14 X2.P5
PDI-CLK
  Top 0.152: IC2.35 37.23,46.11 36.92,46.42 36.92,53.58 36.61,53.89 34.22,53.89 PDI.P$3
PDI-DATA
  Top 0.152: IC2.34 38.2,55.96 37.83,56.33 34.21,56.33 PDI.P$2
STATE  (via drill 0.35)
  Top 0.152: IC2.36 37.98,45.31 37.98,45.36 37.07,45.36 36.61,45.81 36.61,49.32 v36.16,49.77 | v48.5,50.38 48.5,51.57 R1.2
  Bottom 0.152: v36.16,49.77 36.92,49.01 48.04,49.01 48.5,49.47 v48.5,50.38
USB5V  (via drill 0.35 pad 0.65)
  Top 0.305: 37.47,74.6 C14.1 | v37.46,70.13 IC4.20 | L4.1 47.29,67.46 | 37.35,81.07 37.49,81.21 37.49,80.35 C15.+
  Top 0.406: IC4.20 37.47,74.6 37.47,80.3 C15.+
  Top 0.508: v45.6,66.73 46.56,66.73 47.29,67.46 58.04,67.46 58.66,66.84 58.66,62.58 58.18,62.09 | IC1.1 53.19,62.33 C2.2 56.54,62.33 C1.2 58.18,62.09 | 58.18,62.09 72.68,62.09 73.47,61.31 73.47,24.6 | 73.47,24.6 73.42,24.55 65.15,24.55 64.4,23.8 64.4,23.38 C29.1 64.47,20.56 R25.1 64.43,20.38 Q6.1 | X2.P1 73.47,9.07 73.47,24.6
  Top 0.813: 56.79,62.11 C1.2
  Bottom 0.305: v45.6,66.73 39.77,66.73 37.47,69 37.47,70.12 v37.46,70.13
USBDM
  Top 0.305: IC4.16 40.12,72.14 40.12,73.03 40.45,73.36 40.47,73.36 40.62,73.51 42.45,73.51 | IC3.P$6 45.85,73.2 45.53,73.51 42.45,73.51 | C13.1 42.43,73.52 42.45,73.51
USBDP
  Top 0.305: IC4.15 40.72,69.51 41.6,68.63 43.36,68.63 | IC3.P$4 43.95,69.2 43.39,68.63 43.36,68.63 | C12.1 43.37,68.62 43.36,68.63
VCCIO  (via drill 0.35, 0.5)
  Top 0.305: IC1.5 50.48,62.46 | v21.21,61.67 C18.1 19.21,61.67 IC5.5 | v21.21,61.67 | C20.1 18.91,28.7 19.21,28.7 IC7.5 | 18.91,46.1 C19.1 19.21,46.15 IC6.5 | C21.1 19.21,10.37 IC8.5 | C10.1 21.76,44.33 21.34,44.75 v21.19,44.91 | IC9.5 29.2,27.2 C22.1 | IC10.5 33.77,27.26 C23.1 | C27.1 38.76,25.37 IC14.5 | C26.1 43.43,25.37 IC13.5 | C25.1 48.05,25.37 IC12.5
  Top 0.406: C6.1 IC2.9 | IC2.9 | C7.1 IC2.19 47.84,44.51 47.25,43.92 47.25,43.31 46.79,42.85 44.05,42.85 43.9,43.01 | C7.1 | 43.9,43.01 43.9,43.46 43.13,44.22 42.22,44.22 41.55,44.9 IC2.31 C8.1 42.19,51.19 v42.4,51.4 | 43.9,43.01 43.95,42.91 | 43.95,42.91 v43.9,42.91 IC2.39 35.08,42.91 C9.1 | IC2.9 46.34,40.57 45.57,41.33 44.35,41.33 43.95,41.88 43.95,42.91 | C4.1 50.5,60.73 arc-90 50.53,60.7 v50.53,52.82 70.6,52.82 71.4,52.02 R14.2 R15.2 R16.2 R17.2 R18.2 R19.2 R20.2 R21.2 R22.2 R23.2 71.4,26.41 v71.41,26.4 | v35.85,48.49 35.47,48.87 C5.1 34.75,46.89 OSC1.P$4 | v36.31,57.75 37.09,58.53 C16.1 38.78,59.79 38.19,60.38 35.45,60.38 34.22,61.61 IC4.4 | CLKIN.1 30.17,80.4 30.17,78.54 29.25,77.63 22.13,77.63 v21.21,76.71 | 33.76,25.17 IC10.5 | 18.96,10.42 C21.1 19.72,10.37 20.21,10.85 20.21,12.18 v21.19,13.16 | C23.1 32.61,27.43 v32.55,27.49 | C22.1 27.31,27.51 v27.3,27.53 | v46.26,27.42 C25.1 | v41.64,27.42 C26.1 | v37.73,27.42 C27.1 | v21.19,28.68 19.04,28.68 arc90 C20.1 | 19.21,46.15 21.17,46.15 v21.19,46.13
  Top 0.457: 50.48,62.46 C4.1
  Bottom 0.305: v21.21,61.67 21.19,61.64
  Bottom 0.406: v43.9,42.91 43.9,48.19 | 21.19,61.64 21.19,60.76 20.21,59.77 20.21,56.57 21.19,55.59 21.19,46.97 | 21.19,46.97 21.19,46.66 | v21.19,28.68 v21.19,44.91 v21.19,46.13 21.19,46.36 | v21.19,28.68 v21.19,13.16 | 21.19,46.36 21.19,46.66 | 21.49,46.66 25.16,46.66 25.76,47.26 25.76,47.88 26.37,48.49 v35.85,48.49 43.59,48.49 | 21.49,46.66 21.19,46.66 | 21.19,46.97 21.49,46.66 | 21.49,46.66 21.19,46.36 | 44.2,48.49 50.04,48.49 50.53,48.99 v50.53,52.82 | 44.2,48.49 43.59,48.49 | 43.59,48.49 43.9,48.19 | 43.9,48.19 44.2,48.49 | PDI.P$4 36.31,51.29 | 36.31,51.29 42.3,51.29 v42.4,51.4 | v36.31,57.75 36.31,51.65 | 36.31,51.65 36.31,51.29 | 36.31,51.65 36,51.35 36.61,51.35 36.31,51.65 | v21.21,76.71 v21.21,61.67 | v46.26,27.42 v41.64,27.42 v37.73,27.42 37.66,27.49 v32.55,27.49 27.34,27.49 v27.3,27.53 26.15,28.68 v21.19,28.68 | v71.41,26.4 71.41,11.16 70.8,10.55 67.91,10.55 67.45,10.09 67.45,8.09 X2.P3

### Text on the board
tPlace: Licensed under the TAPR / Open Hardware License / (www.tapr.org/OHL) | INPUT0 | (59, 78) | - | + | synchronizer v1.1 | Hardware Platform | www.cf-hw.org | INPUT1 | Inputs | - | 0 | 1 | + | 2 | 3 | 4 | INPUT2 | 5 | 6 | Note: 5V max / on all inputs | 7 | - | 8 | + | Outputs | 0 | INPUT3 | (77, 16) | - | + | GND | INPUT4 | INPUT5 | GND | INPUT6 | INPUT7 | INPUT8 | GND | GND | OUTPUT0 | GND | 3V | GND | 5V | (21, 7) | Licensed under the TAPR Open / Hardware License (www.tapr.org/OHL) / / Copyright 2020 Artur Silva and Filipe Carvalho